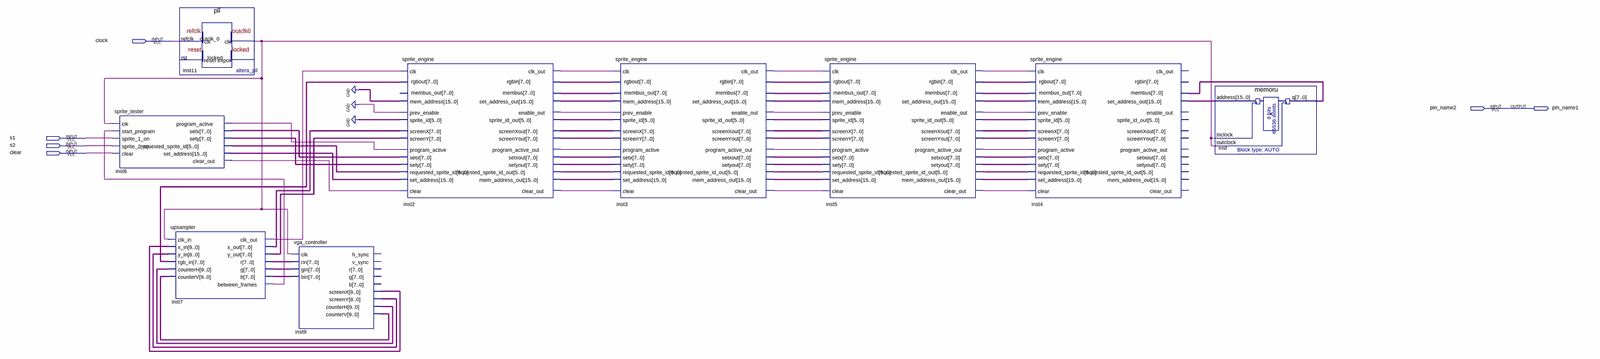
[diagram p0: schematic sheet, whole]
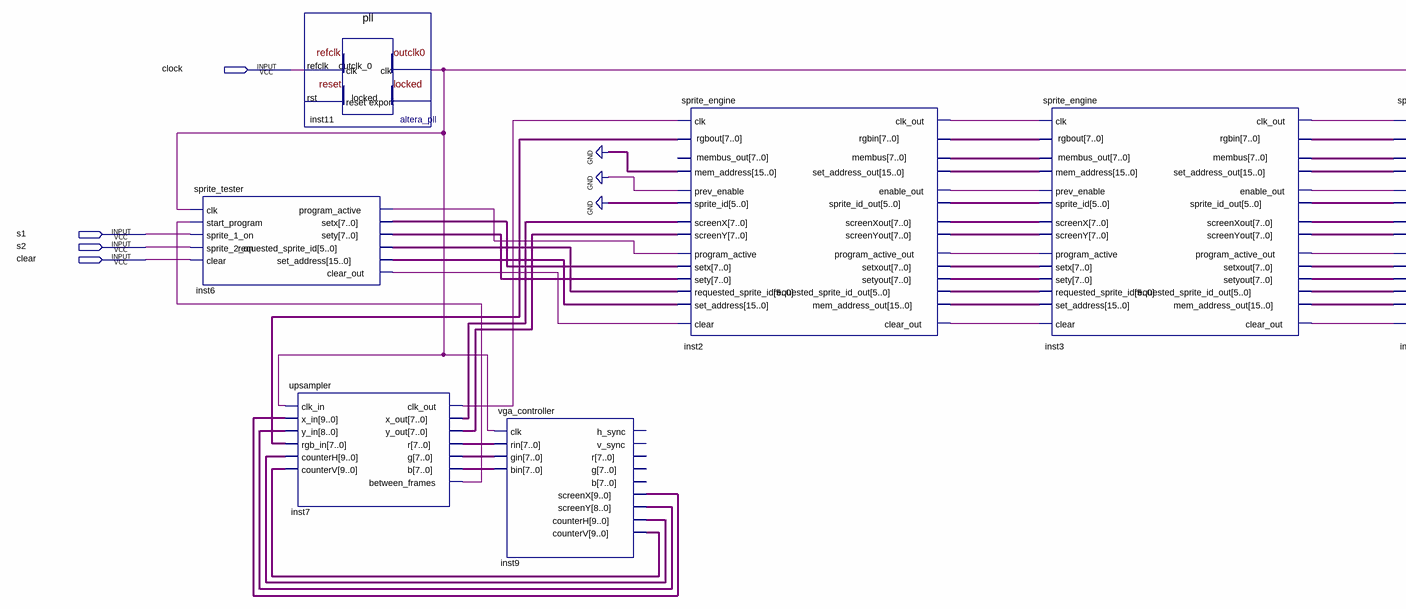
[diagram p1: schematic sheet, left part]
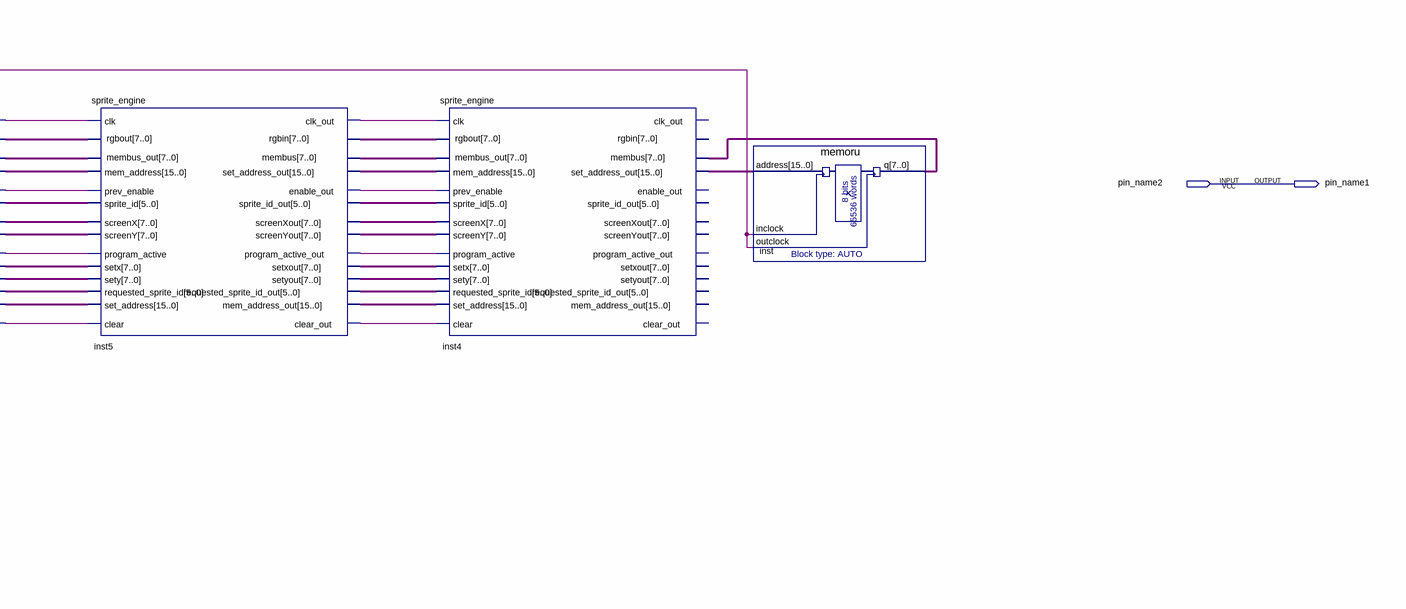
[diagram p2: schematic sheet, right part]
// Quartus schematic memtest.bdf as structural Verilog: 9 symbols, 6 pins
module memtest (
  input  clock,
  input  pin_name2,
  input  s1,
  input  s2,
  input  clear,
  output pin_name1
);

  wire inst2_clear_out, inst2_clk_out, inst2_enable_out, inst2_program_active_out, inst3_clear_out,
       inst3_clk_out, inst3_enable_out, inst3_program_active_out, inst5_clear_out, inst5_clk_out,
       inst5_enable_out, inst5_program_active_out, inst6_clear_out, inst6_program_active,
       inst7_between_frames, inst7_clk_out, inst11_outclk_0;
  wire [5:0] inst2_requested_sprite_id_out, inst2_sprite_id_out, inst3_requested_sprite_id_out,
       inst3_sprite_id_out, inst5_requested_sprite_id_out, inst5_sprite_id_out, inst6_requested_sprite_id;
  wire [7:0] inst2_rgbout, inst2_screenxout, inst2_screenyout, inst2_setxout, inst2_setyout,
       inst3_membus_out, inst3_rgbout, inst3_screenxout, inst3_screenyout, inst3_setxout, inst3_setyout,
       inst4_membus_out, inst4_rgbout, inst5_membus_out, inst5_rgbout, inst5_screenxout, inst5_screenyout,
       inst5_setxout, inst5_setyout, inst6_setx, inst6_sety, inst7_b, inst7_g, inst7_r, inst7_x_out,
       inst7_y_out, inst_q;
  wire [8:0] inst9_screeny;
  wire [9:0] inst9_counterh, inst9_counterv, inst9_screenx;
  wire [15:0] inst2_mem_address_out, inst2_set_address_out, inst3_mem_address_out, inst3_set_address_out,
       inst4_set_address_out, inst5_mem_address_out, inst5_set_address_out, inst6_set_address;

  sprite_tester inst6 (
    .clk(inst11_outclk_0), .start_program(inst7_between_frames), .sprite_1_on(s1), .sprite_2_on(s2),
    .clear(clear), .program_active(inst6_program_active), .setx(inst6_setx), .sety(inst6_sety),
    .requested_sprite_id(inst6_requested_sprite_id), .set_address(inst6_set_address),
    .clear_out(inst6_clear_out));
  pll inst11 (.refclk(clock), .outclk_0(inst11_outclk_0));  // open: rst, locked
  upsampler inst7 (
    .clk_in(inst11_outclk_0), .x_in(inst9_screenx), .y_in(inst9_screeny), .rgb_in(inst2_rgbout),
    .counterH(inst9_counterh), .counterV(inst9_counterv), .clk_out(inst7_clk_out), .x_out(inst7_x_out),
    .y_out(inst7_y_out), .r(inst7_r), .g(inst7_g), .b(inst7_b), .between_frames(inst7_between_frames));
  vga_controller inst9 (
    .clk(inst11_outclk_0), .rin(inst7_r), .gin(inst7_g), .bin(inst7_b), .screenX(inst9_screenx),
    .screenY(inst9_screeny), .counterH(inst9_counterh), .counterV(inst9_counterv));  // open: h_sync, v_sync, r, g, b
  sprite_engine inst2 (
    .clk(inst7_clk_out), .prev_enable(1'b0), .sprite_id({6{1'b0}}), .screenX(inst7_x_out),
    .screenY(inst7_y_out), .requested_sprite_id(inst6_requested_sprite_id), .set_address(inst6_set_address),
    .program_active(inst6_program_active), .mem_address({16{1'b0}}), .rgbin(inst3_rgbout),
    .membus(inst3_membus_out), .clear(inst6_clear_out), .setx(inst6_setx), .sety(inst6_sety),
    .rgbout(inst2_rgbout), .clk_out(inst2_clk_out), .mem_address_out(inst2_mem_address_out),
    .enable_out(inst2_enable_out), .sprite_id_out(inst2_sprite_id_out), .screenXout(inst2_screenxout),
    .screenYout(inst2_screenyout), .program_active_out(inst2_program_active_out), .setxout(inst2_setxout),
    .setyout(inst2_setyout), .requested_sprite_id_out(inst2_requested_sprite_id_out),
    .set_address_out(inst2_set_address_out), .clear_out(inst2_clear_out));  // open: membus_out
  sprite_engine inst3 (
    .clk(inst2_clk_out), .prev_enable(inst2_enable_out), .sprite_id(inst2_sprite_id_out),
    .screenX(inst2_screenxout), .screenY(inst2_screenyout),
    .requested_sprite_id(inst2_requested_sprite_id_out), .set_address(inst2_mem_address_out),
    .program_active(inst2_program_active_out), .mem_address(inst2_set_address_out), .rgbin(inst5_rgbout),
    .membus(inst5_membus_out), .clear(inst2_clear_out), .setx(inst2_setxout), .sety(inst2_setyout),
    .rgbout(inst3_rgbout), .membus_out(inst3_membus_out), .clk_out(inst3_clk_out),
    .mem_address_out(inst3_mem_address_out), .enable_out(inst3_enable_out),
    .sprite_id_out(inst3_sprite_id_out), .screenXout(inst3_screenxout), .screenYout(inst3_screenyout),
    .program_active_out(inst3_program_active_out), .setxout(inst3_setxout), .setyout(inst3_setyout),
    .requested_sprite_id_out(inst3_requested_sprite_id_out), .set_address_out(inst3_set_address_out),
    .clear_out(inst3_clear_out));
  sprite_engine inst5 (
    .clk(inst3_clk_out), .prev_enable(inst3_enable_out), .sprite_id(inst3_sprite_id_out),
    .screenX(inst3_screenxout), .screenY(inst3_screenyout),
    .requested_sprite_id(inst3_requested_sprite_id_out), .set_address(inst3_mem_address_out),
    .program_active(inst3_program_active_out), .mem_address(inst3_set_address_out), .rgbin(inst4_rgbout),
    .membus(inst4_membus_out), .clear(inst3_clear_out), .setx(inst3_setxout), .sety(inst3_setyout),
    .rgbout(inst5_rgbout), .membus_out(inst5_membus_out), .clk_out(inst5_clk_out),
    .mem_address_out(inst5_mem_address_out), .enable_out(inst5_enable_out),
    .sprite_id_out(inst5_sprite_id_out), .screenXout(inst5_screenxout), .screenYout(inst5_screenyout),
    .program_active_out(inst5_program_active_out), .setxout(inst5_setxout), .setyout(inst5_setyout),
    .requested_sprite_id_out(inst5_requested_sprite_id_out), .set_address_out(inst5_set_address_out),
    .clear_out(inst5_clear_out));
  sprite_engine inst4 (
    .clk(inst5_clk_out), .prev_enable(inst5_enable_out), .sprite_id(inst5_sprite_id_out),
    .screenX(inst5_screenxout), .screenY(inst5_screenyout),
    .requested_sprite_id(inst5_requested_sprite_id_out), .set_address(inst5_mem_address_out),
    .program_active(inst5_program_active_out), .mem_address(inst5_set_address_out), .membus(inst_q),
    .clear(inst5_clear_out), .setx(inst5_setxout), .sety(inst5_setyout), .rgbout(inst4_rgbout),
    .membus_out(inst4_membus_out), .set_address_out(inst4_set_address_out));  // open: rgbin, clk_out, mem_address_out, enable_out, sprite_id_out, screenXout, screenYout, program_active_out, setxout, setyout, requested_sprite_id_out, clear_out
  memoru inst (.address(inst4_set_address_out), .inclock(inst11_outclk_0), .outclock(inst11_outclk_0), .q(inst_q));

  assign pin_name1 = pin_name2;
endmodule
